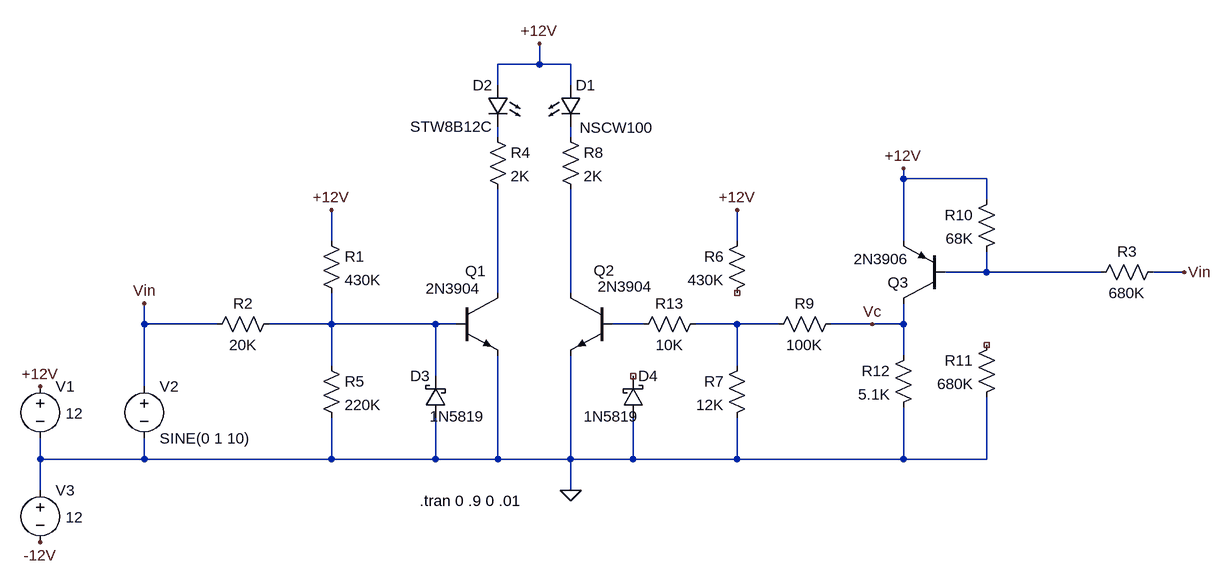
[diagram p0: schematic sigmon.asc]
sigmon.asc, the LTspice schematic file:
Version 4
SHEET 1 1428 740
WIRE 304 -96 304 -128
WIRE 304 -96 240 -96
WIRE 352 -96 304 -96
WIRE 240 -64 240 -96
WIRE 352 -64 352 -96
WIRE 240 16 240 0
WIRE 352 16 352 0
WIRE 864 80 864 64
WIRE 992 80 864 80
WIRE 992 112 992 80
WIRE -16 176 -16 128
WIRE 608 176 608 128
WIRE 864 176 864 80
WIRE 992 224 992 192
WIRE 992 224 928 224
WIRE 1168 224 992 224
WIRE 1296 224 1248 224
WIRE 240 256 240 96
WIRE 352 256 352 96
WIRE -304 304 -304 272
WIRE -192 304 -304 304
WIRE -16 304 -16 256
WIRE -16 304 -112 304
WIRE 144 304 -16 304
WIRE 176 304 144 304
WIRE 464 304 416 304
WIRE 608 304 544 304
WIRE 672 304 608 304
WIRE 816 304 752 304
WIRE 864 304 864 272
WIRE 864 304 816 304
WIRE 864 352 864 304
WIRE -16 368 -16 304
WIRE 608 368 608 304
WIRE 144 384 144 304
WIRE -304 400 -304 304
WIRE -464 512 -464 480
WIRE -304 512 -304 480
WIRE -304 512 -464 512
WIRE -16 512 -16 448
WIRE -16 512 -304 512
WIRE 144 512 144 448
WIRE 144 512 -16 512
WIRE 240 512 240 352
WIRE 240 512 144 512
WIRE 352 512 352 352
WIRE 352 512 240 512
WIRE 448 512 448 448
WIRE 448 512 352 512
WIRE 608 512 608 448
WIRE 608 512 448 512
WIRE 864 512 864 432
WIRE 864 512 608 512
WIRE 992 512 992 416
WIRE 992 512 864 512
WIRE -464 560 -464 512
WIRE 352 560 352 512
FLAG 352 560 0
FLAG -464 400 +12V
FLAG -16 128 +12V
FLAG 304 -128 +12V
FLAG -304 272 Vin
FLAG -464 640 -12V
FLAG 608 128 +12V
FLAG 864 64 +12V
FLAG 1296 224 Vin
FLAG 816 304 Vc
SYMBOL LED 336 -64 R0
WINDOW 3 30 65 Left 2
SYMATTR InstName D1
SYMATTR Value NSCW100
SYMBOL LED 256 -64 M0
SYMATTR InstName D2
SYMATTR Value STW8B12C
SYMBOL npn 176 256 R0
WINDOW 0 14 -34 Left 2
WINDOW 3 -47 -7 Left 2
SYMATTR InstName Q1
SYMATTR Value 2N3904
SYMBOL npn 416 256 M0
WINDOW 0 -4 -35 Left 2
WINDOW 3 -62 -10 Left 2
SYMATTR InstName Q2
SYMATTR Value 2N3904
SYMBOL res -32 160 R0
SYMATTR InstName R1
SYMATTR Value 430K
SYMBOL res -96 288 R90
WINDOW 0 0 56 VBottom 2
WINDOW 3 32 56 VTop 2
SYMATTR InstName R2
SYMATTR Value 20K
SYMBOL voltage -464 384 R0
WINDOW 3 39 57 Left 2
WINDOW 123 0 0 Left 0
WINDOW 39 0 0 Left 0
SYMATTR InstName V1
SYMATTR Value 12
SYMBOL res 1264 208 R90
WINDOW 0 0 56 VBottom 2
WINDOW 3 32 56 VTop 2
SYMATTR InstName R3
SYMATTR Value 680K
SYMBOL voltage -304 384 R0
WINDOW 123 0 0 Left 0
WINDOW 39 0 0 Left 0
SYMATTR InstName V2
SYMATTR Value SINE(0 1 10)
SYMBOL res 224 0 R0
SYMATTR InstName R4
SYMATTR Value 2K
SYMBOL res -32 352 R0
SYMATTR InstName R5
SYMATTR Value 220K
SYMBOL voltage -464 544 R0
WINDOW 3 39 57 Left 2
WINDOW 123 0 0 Left 0
WINDOW 39 0 0 Left 0
SYMATTR InstName V3
SYMATTR Value 12
SYMBOL schottky 160 448 R180
WINDOW 0 24 64 Left 2
WINDOW 3 -60 2 Left 2
SYMATTR InstName D3
SYMATTR Value 1N5819
SYMATTR Description Diode
SYMATTR Type diode
SYMBOL res 624 160 M0
SYMATTR InstName R6
SYMATTR Value 430K
SYMBOL res 624 352 M0
SYMATTR InstName R7
SYMATTR Value 12K
SYMBOL schottky 432 448 M180
WINDOW 0 24 64 Left 2
WINDOW 3 -60 2 Left 2
SYMATTR InstName D4
SYMATTR Value 1N5819
SYMATTR Description Diode
SYMATTR Type diode
SYMBOL res 336 0 R0
SYMATTR InstName R8
SYMATTR Value 2K
SYMBOL res 768 288 R90
WINDOW 0 0 56 VBottom 2
WINDOW 3 32 56 VTop 2
SYMATTR InstName R9
SYMATTR Value 100K
SYMBOL pnp 928 272 R180
SYMATTR InstName Q3
SYMATTR Value 2N3906
SYMBOL res 1008 96 M0
SYMATTR InstName R10
SYMATTR Value 68K
SYMBOL res 1008 320 M0
SYMATTR InstName R11
SYMATTR Value 680K
SYMBOL res 880 336 M0
SYMATTR InstName R12
SYMATTR Value 5.1K
SYMBOL res 560 288 R90
WINDOW 0 0 56 VBottom 2
WINDOW 3 32 56 VTop 2
SYMATTR InstName R13
SYMATTR Value 10K
TEXT 120 576 Left 2 !.tran 0 .9 0 .01

The netlist it stands for:
* sigmon.asc
D1 +12V N002 NSCW100
D2 +12V N001 STW8B12C
Q1 N004 N006 0 0 2N3904
Q2 N005 N007 0 0 2N3904
R1 +12V N006 430K
R2 N006 Vin 20K
V1 +12V 0 12
R3 Vin N003 680K
V2 Vin 0 SINE(0 1 10)
R4 N001 N004 2K
R5 N006 0 220K
V3 0 -12V 12
D3 0 N006 1N5819
R6 +12V NC_01 430K
R7 N008 0 12K
D4 0 NC_02 1N5819
R8 N002 N005 2K
R9 Vc N008 100K
Q3 Vc N003 +12V 0 2N3906
R10 +12V N003 68K
R11 NC_03 0 680K
R12 Vc 0 5.1K
R13 N008 N007 10K
.model D D
.lib standard.dio
.model NPN NPN
.model PNP PNP
.lib standard.bjt
.tran 0 .9 0 .01
.backanno
.end